# EAGLE design GateWay (EAGLE 8.6.0)
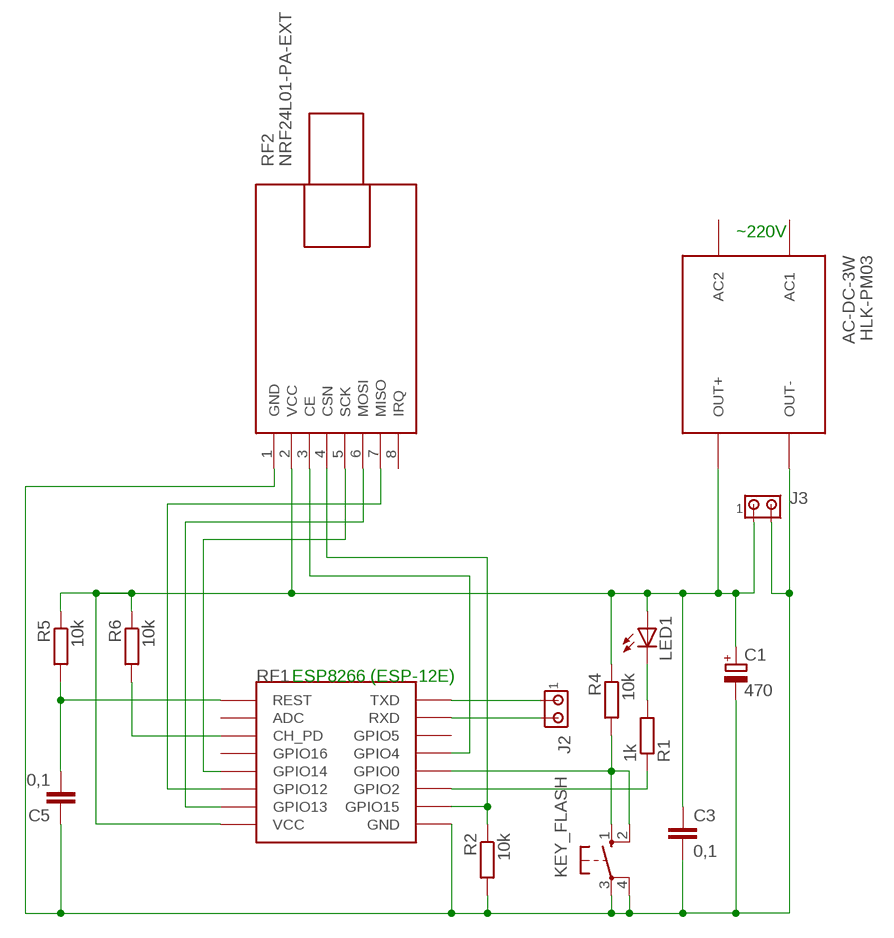
[diagram p0: schematic, sheet 1]

## Parts
C1  470  CPOL-EUE2,5-6E  [E2,5-6E]
C3  0,1  C-EU025-024X044  [C025-024X044]
C5  0,1  C-EU025-025X050  [C025-025X050]
HLK-PM03  AC-DC-3W  AC-DC-3.5W  [AC-DC-3.5W]
J2  MTA02-100  [10X02MTA]
J3  MTA02-100  [10X02MTA]
KEY_FLASH  10-XX  [B3F-10XX]
LED1  LED5MM  [LED5MM]
R1  1k  R-EU_0204/7  [0204/7]
R2  10k  R-EU_0204/7  [0204/7]
R4  10k  R-EU_0204/7  [0204/7]
R5  10k  R-EU_0207/12  [0207/12]
R6  10k  R-EU_0207/10  [0207/10]
RF1  ESP  ESP12ESMD  [ESP12E-SMD]
RF2  NRF24L01-PA-EXT  WIRELESS-NRF24L01-PA-EXT  [WIRELESS-NRF24L01-PA-EXT]

## Nets
CHS: R6.2 RF1.CH_PD
FLASH: KEY_FLASH.1(S) KEY_FLASH.2(S1) R4.2 RF1.GPIO0
GND: C1.- C3.2 C5.1 HLK-PM03.J2.1(OUT-) J3.2 KEY_FLASH.3(P) KEY_FLASH.4(P1) R2.2 RF1.GND RF2.1(GND)
GPIO4: RF1.GPIO4 RF2.3(CE)
GPIO12: RF1.GPIO12 RF2.7(MISO)
GPIO13: RF1.GPIO13 RF2.6(MOSI)
GPIO14: RF1.GPIO14 RF2.5(SCK)
GPIO15: R2.1 RF1.GPIO15 RF2.4(CSN)
LED: R1.1 RF1.GPIO2
N$1: LED1.K(C) R1.2
RESET: C5.2 R5.2 RF1.RESET(REST)
RX: J2.2 RF1.RXD0(RXD)
TX: J2.1 RF1.TXD0(TXD)
VCC: C1.+ C3.1 HLK-PM03.J2.3(OUT+) J3.1 LED1.A R4.1 R5.1 R6.1 RF1.VCC RF2.2(VCC)
Unconnected: HLK-PM03.J1.1(AC1) HLK-PM03.J1.2(AC2) RF1.ADC RF1.GPIO5 RF1.GPIO16 RF2.8(IRQ)

## Notes on the sheet
- ~220V
- ESP8266 (ESP-12E)

## Library data of the parts
C1 = rcl:CPOL-EU: POLARIZED CAPACITOR, European symbol; SPICEPREFIX: C
C3 C5 = rcl:C-EU: CAPACITOR, European symbol; SPICEPREFIX: C
HLK-PM03 = diy-modules:AC-DC-3.5W: AC/DC 3.5W Converter More details available here: https://www.itead.cc/wiki/AC-DC_Power_Module_5V_700mA Click here to find device on ebay.com <http://www.ebay.com/sch/ac+dc+3.5w+buck+step>
J2 J3 = con-amp:MTA02-100: AMP connector
KEY_FLASH = switch-omron:10-XX: OMRON SWITCH; MPN: B3F-1000; OC_FARNELL: 176432; OC_NEWARK: 36M3542
LED1 = led:LED: LED OSRAM: - CHIPLED LG R971, LG N971, LY N971, LG Q971, LY Q971, LO R971, LY R971 LH N974, LH R974 LS Q976, LO Q976, LY Q976 LO Q996 - Hyper CHIPLED LW Q18S LB Q993, LB Q99A, LB R99A - SideLED LS A670, LO A670, LY A670, LG A670, LP A670 LB A673, LV A673, LT A673, LW A673 LH A674 LY A675 LS A676, LA A676, LO A676, LY A676, LW A676 LS A679, LY A679, LG A679 - Hyper Micro SIDELED® LS Y876, LA Y876, LO Y876, LY Y876 LT Y87S - SmartLED LW L88C, LW L88S LB L89C, LB L89S, LG L890 LS L89K, LO L89K, LY L89K LS L896, LA L896, LO L896, LY L896 - TOPLED LS T670, LO T670, LY T670, LG T670, LP T670 LSG T670, LSP T670, LSY T670, LOP T670, LYG T670 LG T671, LOG T671, LSG T671 LB T673, LV T673, LT T673, LW T673 LH T674 LS T676, LA T676, LO T676, LY T676, LB T676, LH T676, LSB T676, LW T676 LB T67C, LV T67C, LT T67C, LS T67K, LO T67K, LY T67K, LW E67C LS E67B, LA E67B, LO E67B, LY E67B, LB E67C, LV E67C, LT E67C LW T67C LS T679, LY T679, LG T679 LS T770, LO T770, LY T770, LG T770, LP T770 LB T773, LV T773, LT T773, LW T773 LH T774 LS E675, LA E675, LY E675, LS T675 LS T776, LA T776, LO T776, LY T776, LB T776 LHGB T686 LT T68C, LB T68C - Hyper Mini TOPLED® LB M676 - Mini TOPLED Santana® LG M470 LS M47K, LO M47K, LY M47K Source: http://www.osram.convergy.de LUXEON: - LUMILED® LXK2-PW12-R00, LXK2-PW12-S00, LXK2-PW14-U00, LXK2-PW14-V00 LXK2-PM12-R00, LXK2-PM12-S00, LXK2-PM14-U00 LXK2-PE12-Q00, LXK2-PE12-R00, LXK2-PE12-S00, LXK2-PE14-T00, LXK2-PE14-U00 LXK2-PB12-K00, LXK2-PB12-L00, LXK2-PB12-M00, LXK2-PB14-N00, LXK2-PB14-P00, LXK2-PB14-Q00 LXK2-PR12-L00, LXK2-PR12-M00, LXK2-PR14-Q00, LXK2-PR14-R00 LXK2-PD12-Q00, LXK2-PD12-R00, LXK2-PD12-S00 LXK2-PH12-R00, LXK2-PH12-S00 LXK2-PL12-P00, LXK2-PL12-Q00, LXK2-PL12-R00 Source: www.luxeon.com KINGBRIGHT: KA-3528ASYC Source: www.kingbright.com
R1 R2 R4-R6 = rcl:R-EU_: RESISTOR, European symbol; SPICEPREFIX: R
RF1 = esp8266modules:ESP12E: ESP12E Module
RF2 = diy-modules:WIRELESS-NRF24L01-PA-EXT: 2.4 GHz Wireless Module based on NRF24L01 chip with preamplifier and external antenna Click here to find device on ebay.com <http://www.ebay.com/sch/nrf24l01+pa+lna+sma>

## Board
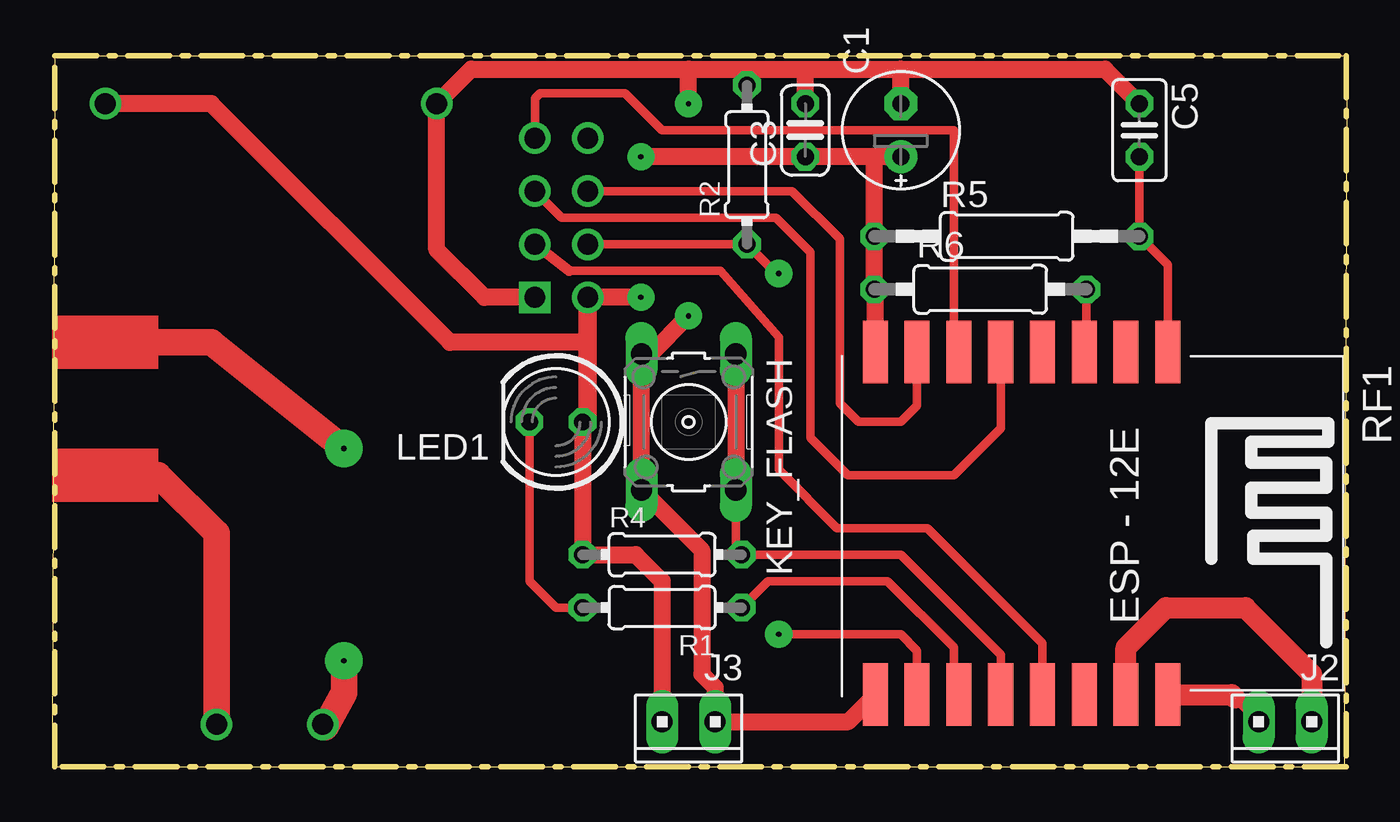
[diagram p1: board, top side]
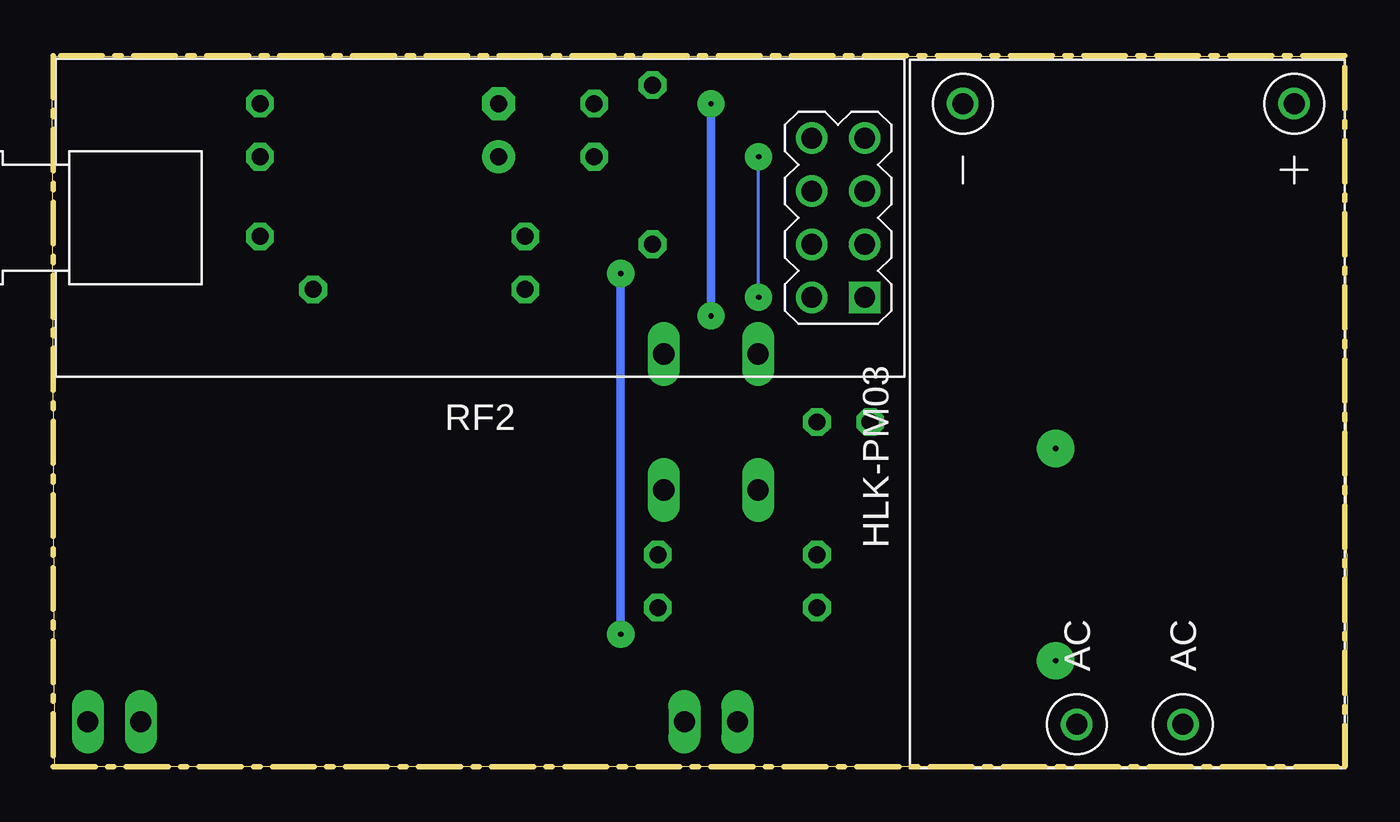
[diagram p2: board, bottom side, seen from below]

Size 62.03 x 34.04 mm. Coordinates in mm from the lower left corner, seen from the top.
Outline: 0.13,34.04 61.98,34.04 61.98,0 0.13,0 0.13,33.91
Outline: 0,0 61.9,0 62.03,34.03 0.13,34.03 0,0
Copper layers (1*16): Top 0.035mm / dielectric 1.5mm / Bottom 0.035mm
Design rules "default": minimum track width 6mil, minimum drill 0.35mm, track to track 6mil, track to pad 6mil, pad to pad 6mil, via to via 6mil, smd to smd 6mil, copper to edge 40mil, drill to drill 6mil, minimum pad ring 10mil, minimum via ring 8mil, stop-mask expansion 4mil, vias tented up to drill 0mil, thermal gap 10mil

### Footprints (pad centres in the part's own frame; a part is rotated, then mirrored left to right if it is on the bottom)
E2,5-6E = drill 0.813 pad 1.575: + -1.27,0 | drill 0.813 pad 1.575 octagon: - 1.27,0
C025-024X044 = drill 0.813 octagon: 1 -1.27,0; 2 1.27,0
C025-025X050 = drill 0.813 octagon: 1 -1.27,0; 2 1.27,0
AC-DC-3.5W = drill 1: J1.1 -12.827,2.413; J1.2 -12.827,-2.667; J2.1 16.891,7.874; J2.3 16.891,-8.001
10X02MTA = drill 1.016 long: 1 1.27,0; 2 -1.27,0
B3F-10XX = drill 1.016 long: 1 -3.251,2.261; 2 3.251,2.261; 3 -3.251,-2.261; 4 3.251,-2.261
LED5MM = drill 0.813 octagon: A -1.27,0; K 1.27,0
0204/7 = drill 0.813 octagon: 1 -3.81,0; 2 3.81,0
0207/12 = drill 0.813 octagon: 1 -6.35,0; 2 6.35,0
0207/10 = drill 0.813 octagon: 1 -5.08,0; 2 5.08,0
ESP12E-SMD = smd 3 x 1.2: ADC -8.3,3.8; CH_PD -8.3,1.8; GND 8.1,-8.2; GPIO0 8.1,-2.2; GPIO2 8.1,-4.2; GPIO4 8.1,-0.2; GPIO5 8.1,1.8; GPIO12 -8.3,-4.2; GPIO13 -8.3,-6.2; GPIO14 -8.3,-2.2; GPIO15 8.1,-6.2; GPIO16 -8.3,-0.2; RESET -8.3,5.8; RXD0 8.1,3.8; TXD0 8.1,5.8; VCC -8.3,-8.2
WIRELESS-NRF24L01-PA-EXT = drill 1 square: 1 -18.415,3.81 | drill 1: 2 -15.875,3.81; 3 -18.415,1.27; 4 -15.875,1.27; 5 -18.415,-1.27; 6 -15.875,-1.27; 7 -18.415,-3.81; 8 -15.875,-3.81

### Placement (x,y rotation side)
C1  40.64,30.48 90 top
C3  36.07,30.48 90 top
C5  52.07,30.48 270 top
HLK-PM03  10.54,14.86 90 bottom
J2  59.05,2.16 180 top
J3  30.48,2.16 180 top
KEY_FLASH  30.48,16.51 270 top
LED1  24.13,16.51 180 top
R1  29.21,7.62 180 top
R2  33.27,28.83 90 top
R4  29.21,10.16 0 top
R5  45.72,25.4 0 top
R6  44.45,22.86 0 top
RF1  47.62,11.56 270 top
RF2  41.53,26.29 180 bottom

### Tracks (layer width: path | path; a pad name or v marks a point on that pad's centre or on a via)
CHS
  Top 0.406: R6.2 49.53,19.96 RF1.CH_PD
FLASH
  Top 0.406: RF1.GPIO0 45.42,5.38 40.64,10.16 R4.2 32.74,10.44 32.74,13.21 KEY_FLASH.2 KEY_FLASH.1
  Top 0.813: KEY_FLASH.1 32.74,13.21
GND  (via drill 0.25 pad 1.3)
  Top 0.406: 18.73,32.07 20.19,33.53 30.48,33.53 | 30.48,33.53 33.27,33.53 | 33.27,33.53 36.07,33.53 | 36.07,33.53 40.64,33.53 | 40.64,33.53 50.29,33.53 C5.1 | 36.07,33.27 36.07,33.53 | 33.27,33.15 33.27,33.53 | 40.64,33.4 40.64,33.53 | 30.48,33.4 30.48,33.53
  Top 0.813: RF2.1 20.7,22.48 18.41,24.77 HLK-PM03.J2.1 | HLK-PM03.J2.1 18.73,32.07 | v30.48,21.59 28.65,19.76 KEY_FLASH.3 KEY_FLASH.4 31.11,10.36 31.11,4.45 31.75,3.81 J3.2 38.13,2.16 RF1.GND | HLK-PM03.J2.1 20.07,33.4 30.48,33.4 | 30.48,33.4 40.64,33.4 | 40.64,33.4 50.42,33.4 C5.1 | C1.- 40.64,33.4 | C3.2 36.07,33.27 | R2.2 33.27,33.15 | v30.48,31.75 30.48,33.4
  Bottom 0.406: v30.48,21.59 v30.48,31.75
GPIO4
  Top 0.406: RF1.GPIO4 47.42,5.92 41.91,11.43 37.59,11.43 34.8,14.22 34.8,20.57 32,23.75 24.77,23.75
  Top 0.508: 24.77,23.75 RF2.3
GPIO12
  Top 0.406: RF1.GPIO12 43.18,20.1 43.18,30.48 29.21,30.48 27.43,32.26 23.37,32.26 23.11,32 RF2.7
GPIO13
  Top 0.406: RF1.GPIO13 41.42,17.3 40.64,16.51 38.61,16.51 37.72,17.4 37.72,25.27 35.43,27.56 RF2.6
GPIO14
  Top 0.152: 45.72,19.86 RF1.GPIO14
  Top 0.406: RF1.GPIO14 45.42,16.21 43.18,13.97 38.1,13.97 36.32,15.75 36.32,24.64 34.67,26.29 34.29,26.29 24.38,26.29 RF2.5
GPIO15  (via drill 0.25 pad 1.3)
  Top 0.406: RF2.4 R2.1 34.67,23.62 v34.8,23.62 | RF1.GPIO15 41.42,5.57 40.64,6.35 v34.8,6.35
  Bottom 0.406: v34.8,6.35 v34.8,23.62
LED
  Top 0.406: RF1.GPIO2 43.18,3.7 43.18,5.71 40.01,8.89 34.29,8.89 R1.1
N$1
  Top 0.406: R1.2 24.13,7.62 22.86,8.89 LED1.K
N$5
  Top 1.27: 7.87,1.91 7.87,11.18 5.08,13.97 1.27,13.97
N$8  (via drill 0.25 pad 1.78)
  Top 1.27: v13.97,5.08 13.97,3.56 13.08,1.91
N$11  (via drill 0.25 pad 1.78)
  Top 1.27: 1.27,20.32 7.62,20.32 v13.97,15.24
RESET
  Top 0.406: C5.2 R5.2 53.42,24.05 RF1.RESET
RX
  Top 1.016: RF1.RXD0 51.42,5.71 53.34,7.62 57.15,7.62 60.33,4.45 J2.2
TX
  Top 0.406: 56.64,3.3 J2.1 | 56.64,3.3
  Top 1.016: RF1.TXD0 56.49,3.46 56.64,3.3
VCC  (via drill 0.25 pad 1.3)
  Top 0.152: 25.4,20.32 25.65,20.32 | 36.83,29.21 39.37,29.21
  Top 0.406: RF2.2 25.4,22.23 25.4,20.32 | 25.4,20.32 LED1.A | 25.4,20.32 19.05,20.32 | v28.19,29.21 35.56,29.21 | 36.83,29.21 C3.1 39.37,29.21 C1.+
  Top 0.813: 25.65,20.32 RF2.2 v28.19,22.48 | 25.65,20.32 25.65,16.76 LED1.A R4.1 27.94,10.16 29.21,8.89 J3.1 | 25.65,20.32 19.05,20.32 7.62,31.75 HLK-PM03.J2.3 | RF1.VCC 39.42,22.8 R6.1 R5.1 39.37,29.21 | C1.+ C3.1 | C3.1 35.56,29.21 | C3.1 v28.19,29.21
  Bottom 0.152: v28.19,22.48 v28.19,29.21
(copper drawn outside any net)
  shapes: Top area x2

### Text on the board
tDocu: ~220V | FUSE
bDocu: ~220V